# Altium schematic sheet OV7670s.SchDoc
size A
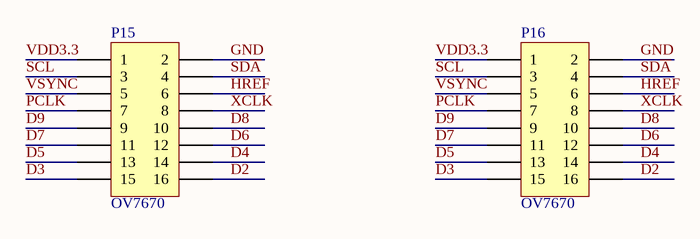
[diagram p0: OV7670s.SchDoc]

## Parts
P15  OV7670  [HDR2X8]
P16  OV7670  [HDR2X8]

## Nets
D2: P15.16 P16.16
D3: P15.15 P16.15
D4: P15.14 P16.14
D5: P15.13 P16.13
D6: P15.12 P16.12
D7: P15.11 P16.11
D8: P15.10 P16.10
D9: P15.9 P16.9
GND: P15.2 P16.2
HREF: P15.6 P16.6
PCLK: P15.7 P16.7
SCL: P15.3 P16.3
SD~{A}: P15.4 P16.4
VDD3.3: P15.1 P16.1
VSYNC: P15.5 P16.5
XCLK: P15.8 P16.8

## Library data of the parts
P15 P16 = Header 8X2: Header, 8-Pin, Dual row; LatestRevisionDate: 17-Jul-2002; LatestRevisionNote: Re-released for DXP Platform.; Publisher: Altium Limited